# Altium project fiverr.PrjPcb
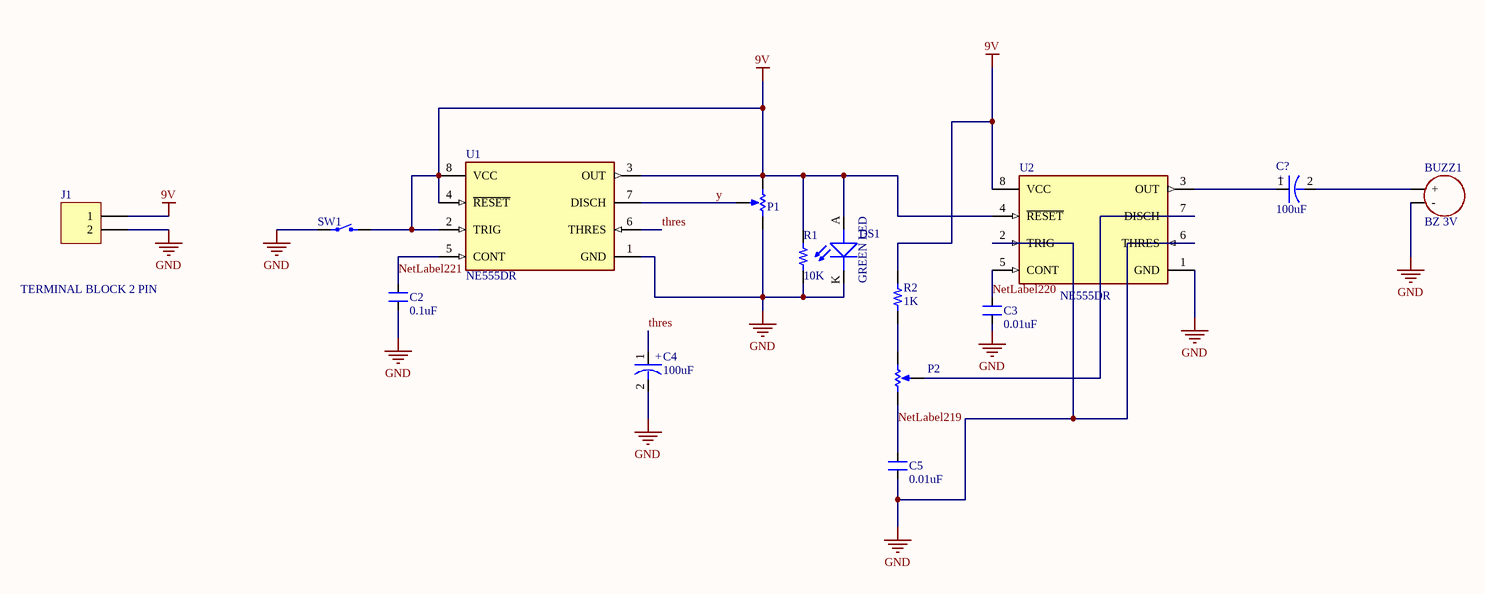
[diagram p0: Sheet1.SchDoc]
1 sheet, 15 parts. Net scope: global (net labels, ports and power ports of the same name join across sheets).
Board file: PCB1.PcbDoc

## Sheet Sheet1.SchDoc
size A3; SheetNumber: 1; SheetTotal: 1

### Parts
BUZZ1  BZ 3V  [BUZ_9MM]
C2  0.1uF  [CAP_0805]
C3  0.01uF  [CAP_0805]
C4  100uF  [ACAP_P305_D393_H393_RAD]
C5  0.01uF  [CAP_0805]
C?  100uF  [ACAP_P305_D393_H393_RAD]
DS1  GREEN LED  [LED_0805]
J1  TERMINAL BLOCK 2 PIN  [CON2_P196_1729128_TH_ST]
P1  10K  [POT TH 7X5]  (value not drawn)
P2  10K  [POT TH 7X5]  (value not drawn)
R1  10K  [RES 1206_3216]
R2  1K  [RES 1206_3216]
SW1  Tactile 2PIN 6X3.5mm H4.57mm (SMD)  [SWPBS_SPST_6X3X5]  (value not drawn)
U1  NE555DR  [FP-D0008A-IPC_A]
U2  NE555DR  [FP-D0008A-IPC_A]

### Nets
9V: DS1.A(ANODE) J1.1 P1.1(TOP) R1.2 R2.2 SW1.2 U1.2(TRIG) U1.3(OUT) U1.4(~{RESET}) U1.8(VCC) U2.4(~{RESET}) U2.8(VCC)
GND: BUZZ1.2(-) C2.1 C3.1 C4.2 C5.1 DS1.K(CATHODE) J1.2 P1.3(BOT) R1.1 SW1.1 U1.1(GND) U2.1(GND) U2.2(TRIG) U2.6(THRES)
NetLabel219: C5.2 P2.1(TOP)
NetLabel220: C3.2 U2.5(CONT)
NetLabel221: C2.2 U1.5(CONT)
thres: C4.1 U1.6(THRES)
y: P1.2(TAP) U1.7(DISCH)
NetBUZZ1_1: BUZZ1.1(+) C?.2
NetC?_1: C?.1 U2.3(OUT)
NetP2_2: P2.2(TAP) U2.7(DISCH)
NetP2_3: P2.3(BOT) R2.1

### Notes on the sheet
- (in symbol CAP-P_100uF-50V-20%-RAD) +

### Library data of the parts
BUZZ1 = Buzzer 3V 9mm (THD): Buzzers Transducer, Externally Driven Magnetic 3V 80mA 2.73kHz 85dB @ 3V, 10cm Through Hole PC Pins; PartNumber: CST-931AP
C2 C3 C5 = CAP_2.2nF-50V-10%-0805: 2200pF ±10% 50V Ceramic Capacitor C0G, NP0 0805 (2012 Metric); Manufacturer: KEMET; Manufacturer Part Number: C0805C222K5GEC7800; Alternate Part Number-1: NA; Case/Package: 0805; Supplier-1: SIRICOM; Supplier Part Number-1: 0805N222J500LT
C4 C? = CAP-P_100uF-50V-20%-RAD: 100µF 50V Aluminum Polymer Capacitor Radial, Can - SMD 28mOhm 4000 Hrs @ 125°C; Manufacturer: Nichicon; Manufacturer Part Number: GYA1H101MCQ1GS; Alternate Part Number-1: VEU101M1HTR-1010; Case/Package: Radial-SMD; Supplier-1: SP ROAD; Supplier Part Number-1: GYA1H101MCQ1GS
DS1 = LED_GREEN-2.2-20mA-0805: Green 569nm LED Indication - Discrete 2.1V 0805 (2012 Metric); Manufacturer: Vishay Lite-On; Manufacturer Part Number: LTST-C171GKT; Alternate Part Number-1: NA; Case/Package: 0805; Supplier-1: SP ROAD; Supplier Part Number-1: LTST-C171GKT
J1 = CON-TB_2X1-196-ST-TH: 2 Pins, 1 Row 5mm Pitch, straight Connector, male; Manufacturer: Phoenix Contact; Manufacturer Part Number: MKDSN1,5/2; Alternate Part Number-1: NA; Case/Package: TH-CON; Supplier-1: SP ROAD; Supplier Part Number-1: MKDSN1,5/2
P1 P2 = Pot 7X5mm (THD): VALUE: 10K
R1 = Res 1206: SMT Resistor; VALUE: 1K
R2 = Res 1206: SMT Resistor; VALUE: 1K
SW1 = Tactile 2PIN 6X3.5mm H4.57mm (SMD): Tactile Switch SPST-NO Top Actuated Surface Mount; PartNumber: FSMSMTR-ND
U1 U2 = CMP-1685-00007-2: IC OSC SGL TIMER 100KHZ 8-SOIC; Low Level Output Current: 200mA; Quiescent Current: 15mA; Min Supply Voltage: 4.5V; Number of Timers/Counters: 1; Max Supply Voltage: 16V; Operating Supply Current: 10mA; High Level Output Current: -200mA; Packaging: Tape and Reel; Frequency: 100kHz; Weight: 0.002561oz; REACH SVHC: No SVHC; Package Quantity: 2500; Width: 3.91mm; Max Operating Temperature: 70°C; Contact Plating: Gold; Lead Free: Lead Free; Number of Pins: 8; Min Operating Temperature: 0°C; Radiation Hardening: No; Length: 4.9mm; Case/Package: SOIC; Height: 1.58mm; Mount: Surface Mount